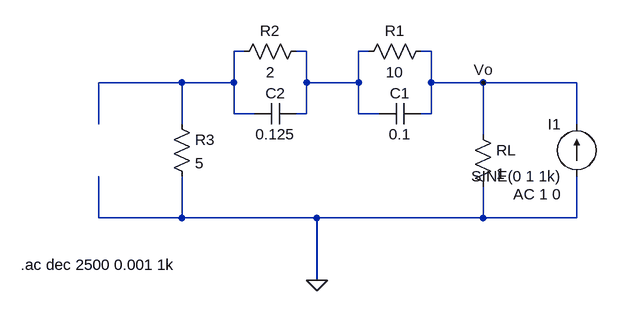
[diagram p0: schematic Ex8.asc]
Ex8.asc, the LTspice schematic file:
Version 4
SHEET 1 880 680
WIRE 304 32 288 32
WIRE 400 32 384 32
WIRE 496 32 480 32
WIRE 592 32 576 32
WIRE 208 80 80 80
WIRE 288 80 288 32
WIRE 288 80 208 80
WIRE 400 80 400 32
WIRE 480 80 480 32
WIRE 480 80 400 80
WIRE 592 80 592 32
WIRE 672 80 592 80
WIRE 816 80 672 80
WIRE 288 128 288 80
WIRE 320 128 288 128
WIRE 400 128 400 80
WIRE 400 128 384 128
WIRE 480 128 480 80
WIRE 512 128 480 128
WIRE 592 128 592 80
WIRE 592 128 576 128
WIRE 80 144 80 80
WIRE 208 144 208 80
WIRE 816 144 816 80
WIRE 672 160 672 80
WIRE 80 288 80 224
WIRE 208 288 208 224
WIRE 208 288 80 288
WIRE 416 288 208 288
WIRE 672 288 672 240
WIRE 672 288 416 288
WIRE 816 288 816 224
WIRE 816 288 672 288
WIRE 416 384 416 288
FLAG 416 384 0
FLAG 672 80 Vo
SYMBOL current 816 224 R180
WINDOW 0 24 80 Left 2
WINDOW 3 24 0 Left 2
WINDOW 123 24 -28 Left 2
WINDOW 39 0 0 Left 0
SYMATTR InstName I1
SYMATTR Value SINE(0 1 1k)
SYMATTR Value2 AC 1 0
SYMBOL res 592 16 R90
WINDOW 0 0 56 VBottom 2
WINDOW 3 32 56 VTop 2
SYMATTR InstName R1
SYMATTR Value 10
SYMBOL res 400 16 R90
WINDOW 0 0 56 VBottom 2
WINDOW 3 32 56 VTop 2
SYMATTR InstName R2
SYMATTR Value 2
SYMBOL cap 576 112 R90
WINDOW 0 0 32 VBottom 2
WINDOW 3 32 32 VTop 2
SYMATTR InstName C1
SYMATTR Value 0.1
SYMBOL cap 384 112 R90
WINDOW 0 0 32 VBottom 2
WINDOW 3 32 32 VTop 2
SYMATTR InstName C2
SYMATTR Value 0.125
SYMBOL res 192 128 R0
SYMATTR InstName R3
SYMATTR Value 5
SYMBOL res 656 144 R0
SYMATTR InstName RL
SYMATTR Value 1
TEXT -40 360 Left 2 !.ac dec 2500 0.001 1k

The netlist it stands for:
* Ex8.asc
I1 0 Vo SINE(0 1 1k) AC 1 0
R1 Vo N002 10
R2 N002 N001 2
C1 Vo N002 0.1
C2 N002 N001 0.125
R3 N001 0 5
RL Vo 0 1
.ac dec 2500 0.001 1k
.backanno
.end